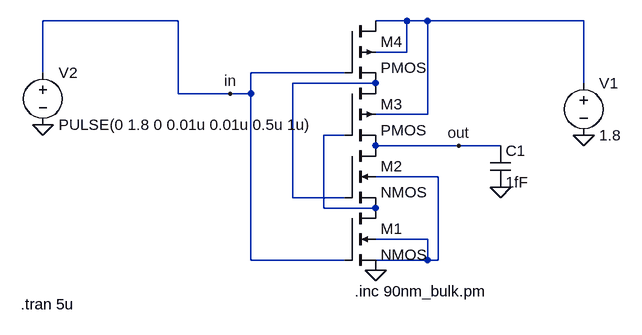
[diagram p0: schematic LCT-trans.asc]
LCT-trans.asc, the LTspice schematic file:
Version 4
SHEET 1 880 680
WIRE -112 -64 -320 -64
WIRE 240 -64 192 -64
WIRE 272 -64 240 -64
WIRE 512 -64 272 -64
WIRE 240 -16 240 -64
WIRE 240 -16 192 -16
WIRE -320 16 -320 -64
WIRE 144 16 0 16
WIRE 192 32 64 32
WIRE 512 32 512 -64
WIRE -112 48 -112 -64
WIRE -32 48 -112 48
WIRE 0 48 0 16
WIRE 0 48 -32 48
WIRE 272 80 272 -64
WIRE 272 80 192 80
WIRE 144 112 112 112
WIRE 320 128 192 128
WIRE 384 128 320 128
WIRE 288 176 192 176
WIRE 64 208 64 32
WIRE 144 208 64 208
WIRE 112 224 112 112
WIRE 192 224 112 224
WIRE 272 272 192 272
WIRE 0 304 0 48
WIRE 144 304 0 304
WIRE 272 304 272 272
WIRE 272 304 192 304
WIRE 288 304 288 176
WIRE 288 304 272 304
FLAG 192 320 0
FLAG 512 112 0
FLAG 384 192 0
FLAG -32 48 in
FLAG 320 128 out
FLAG -320 96 0
SYMBOL nmos4 144 224 R0
SYMATTR InstName M1
SYMATTR Value2 l=100n w=120n
SYMBOL nmos4 144 128 R0
SYMATTR InstName M2
SYMATTR Value2 l=100n w=120n
SYMBOL pmos4 144 32 R0
SYMATTR InstName M3
SYMATTR Value2 l=100n w=400n
SYMBOL pmos4 144 -64 R0
SYMATTR InstName M4
SYMATTR Value2 l=100n w=400n
SYMBOL voltage 512 16 R0
WINDOW 123 0 0 Left 0
WINDOW 39 0 0 Left 0
SYMATTR InstName V1
SYMATTR Value 1.8
SYMBOL cap 368 128 R0
SYMATTR InstName C1
SYMATTR Value 1fF
SYMBOL voltage -320 0 R0
SYMATTR InstName V2
SYMATTR Value PULSE(0 1.8 0 0.01u 0.01u 0.5u 1u)
TEXT 160 352 Left 2 !.inc 90nm_bulk.pm
TEXT -354 372 Left 2 !.tran 5u

The netlist it stands for:
* LCT-trans.asc
M1 N003 in 0 N004 NMOS l=100n w=120n
M2 out N002 N003 N004 NMOS l=100n w=120n
M3 N002 N003 out N001 PMOS l=100n w=400n
M4 N001 in N002 N001 PMOS l=100n w=400n
V1 N001 0 1.8
C1 out 0 1fF
V2 in 0 PULSE(0 1.8 0 0.01u 0.01u 0.5u 1u)
.model NMOS NMOS
.model PMOS PMOS
.lib standard.mos
.inc 90nm_bulk.pm
.tran 5u
.backanno
.end